# Altium schematic sheet audio.SchDoc
size A4
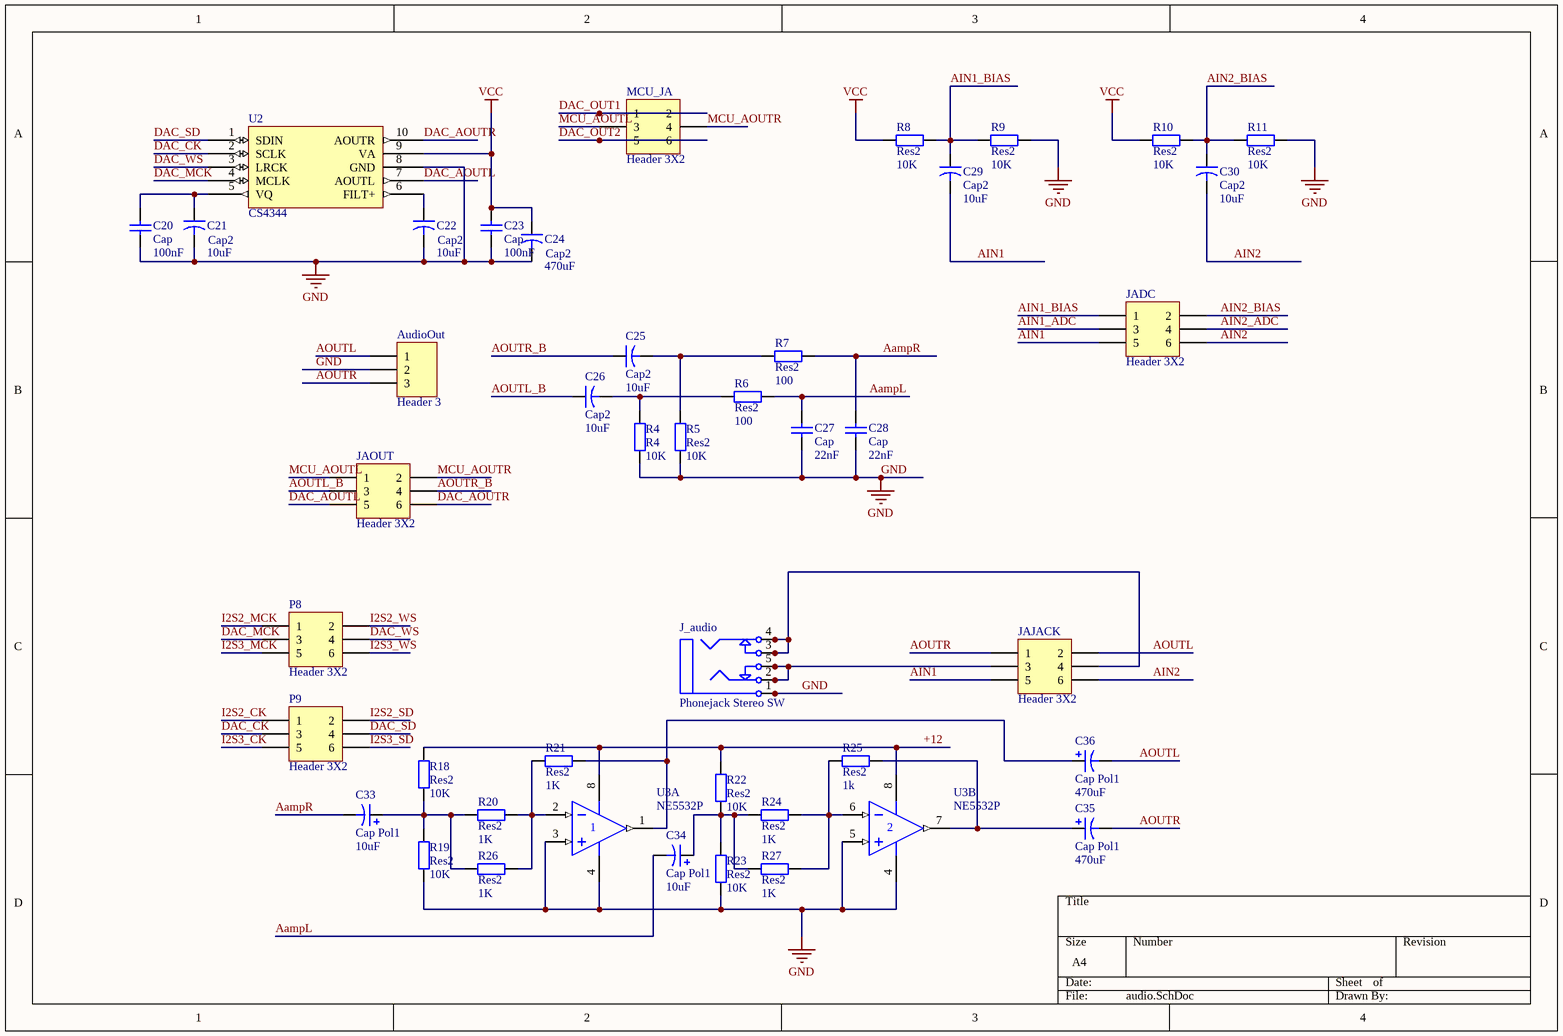
[diagram p0: audio.SchDoc]

## Parts
AudioOut  Header 3  [HDR1X3]
C20  Cap  value 100nF  [1608[0603]]
C21  Cap2  value 10uF  [Cap5x10]
C22  Cap2  value 10uF  [Cap5x10]
C23  Cap  value 100nF  [1608[0603]]
C24  Cap2  value 470uF  [Cap8*14]
C25  Cap2  value 10uF  [Cap5x10]
C26  Cap2  value 10uF  [Cap5x10]
C27  Cap  value 22nF  [1608[0603]]
C28  Cap  value 22nF  [1608[0603]]
C29  Cap2  value 10uF  [Cap5x10]
C30  Cap2  value 10uF  [Cap5x10]
C33  Cap Pol1  value 10uF  [Cap5x10]
C34  Cap Pol1  value 10uF  [Cap5x10]
C35  Cap Pol1  value 470uF  [Cap8*14]
C36  Cap Pol1  value 470uF  [Cap8*14]
J_audio  Phonejack Stereo SW  [AudioJack_3F07]
JADC  Header 3X2  [HDR2X3]
JAJACK  Header 3X2  [HDR2X3]
JAOUT  Header 3X2  [HDR2X3]
MCU_JA  Header 3X2  [HDR2X3]
P8  Header 3X2  [HDR2X3]
P9  Header 3X2  [HDR2X3]
R4  R4  value 10K  [J1-0603]
R5  Res2  value 10K  [J1-0603]
R6  Res2  value 100  [J1-0603]
R7  Res2  value 100  [J1-0603]
R8  Res2  value 10K  [J1-0603]
R9  Res2  value 10K  [J1-0603]
R10  Res2  value 10K  [J1-0603]
R11  Res2  value 10K  [J1-0603]
R18  Res2  value 10K  [J1-0603]
R19  Res2  value 10K  [J1-0603]
R20  Res2  value 1K  [J1-0603]
R21  Res2  value 1K  [J1-0603]
R22  Res2  value 10K  [J1-0603]
R23  Res2  value 10K  [J1-0603]
R24  Res2  value 1K  [J1-0603]
R25  Res2  value 1k  [J1-0603]
R26  Res2  value 1K  [J1-0603]
R27  Res2  value 1K  [J1-0603]
U2  CS4344  [CS4344]
U3  NE5532P  [P008]  (parts A,B of 2)

## Nets
GND: AudioOut.2 C20.1 C21.2 C22.2 C23.1 C24.2 C27.1 C28.1 J_audio.1 J_audio.1A J_audio.1B R4.1 R5.1 R9.2 R11.2 R19.1 R23.1 U2.8(GND) U3.3(IN+) U3.4(V-) U3.5(IN+)
VCC: C23.2 C24.1 R8.1 R10.1 U2.9(VA)
+12: R18.2 R22.2 U3.8(V+)
AampL: C27.2 C34.2 R6.2
AampR: C28.2 C33.2 R7.2
AIN1: C29.2 JADC.5 JAJACK.5
AIN1_ADC: JADC.3
AIN1_BIAS: C29.1 JADC.1 R8.2 R9.1
AIN2: C30.2 JADC.6 JAJACK.6
AIN2_ADC: JADC.4
AIN2_BIAS: C30.1 JADC.2 R10.2 R11.1
AOUTL: AudioOut.1 C36.2 JAJACK.2
AOUTL_B: C26.1 JAOUT.3
AOUTR: AudioOut.3 C35.2 JAJACK.1
AOUTR_B: C25.1 JAOUT.4
DAC_AOUTL: JAOUT.5 U2.7(AOUTL)
DAC_AOUTR: JAOUT.6 U2.10(AOUTR)
DAC_CK: P9.3 U2.2(SCLK)
DAC_MCK: P8.3 U2.4(MCLK)
DAC_OUT1: MCU_JA.1 MCU_JA.2
DAC_OUT2: MCU_JA.5 MCU_JA.6
DAC_SD: P9.4 U2.1(SDIN)
DAC_WS: P8.4 U2.3(LRCK)
I2S2_CK: P9.1
I2S2_MCK: P8.1
I2S2_SD: P9.2
I2S2_WS: P8.2
I2S3_CK: P9.5
I2S3_MCK: P8.5
I2S3_SD: P9.6
I2S3_WS: P8.6
MCU_AOUTL: JAOUT.1 MCU_JA.3
MCU_AOUTR: JAOUT.2 MCU_JA.4
NetC20_2: C20.2 C21.1 U2.5(VQ)
NetC22_1: C22.1 U2.6(FILT+)
NetC25_2: C25.2 R5.2 R7.1
NetC26_2: C26.2 R4.2 R6.1
NetC33_1: C33.1 R18.1 R19.2 R20.2 R26.2
NetC34_1: C34.1 R22.1 R23.2 R24.2 R27.2
NetC35_1: C35.1 R25.1 U3.7(OUT)
NetC36_1: C36.1 R21.1 U3.1(OUT)
NetJ_audio_2: J_audio.2 J_audio.2A J_audio.2B J_audio.5 J_audio.5A J_audio.5B JAJACK.3
NetJ_audio_3: J_audio.3 J_audio.3A J_audio.3B J_audio.4 J_audio.4A J_audio.4B JAJACK.4
NetR20_1: R20.1 R21.2 R26.1 U3.2(IN-)
NetR24_1: R24.1 R25.2 R27.1 U3.6(IN-)

## Library data of the parts
AudioOut = Header 3: Header, 3-Pin; LatestRevisionDate: 17-Jul-2002; LatestRevisionNote: Re-released for DXP Platform.; Publisher: Altium Limited
C20 C23 C27 C28 = Cap: Capacitor; Published: 8-Jun-2000; LatestRevisionDate: 17-Jul-2002; LatestRevisionNote: Re-released for DXP Platform.; PackageReference: RAD-0.3; Publisher: Altium Limited; PackageDescription: Radial Cap, Thru-Hole; 2 Leads; 0.3 in Pin Spacing
C21 C22 C24-C26 C29 C30 = Cap2: Capacitor; Published: 23-Sep-2002; PackageReference: CAPR5-4X5; Publisher: Altium Limited; PackageDescription: Capacitor; 2 Leads
C33-C36 = Cap Pol1: Polarized Capacitor (Radial); Published: 8-Jun-2000; LatestRevisionDate: 17-Jul-2002; LatestRevisionNote: Re-released for DXP Platform.; PackageReference: RB7.6-15; Publisher: Altium Limited; PackageDescription: Polarized Capacitor (Radial); 2 Leads
J_audio = Phonejack Stereo SW: 3-Conductor Jack with 2 break contacts (normals) and 2 auxiliary make contacts; pin to pad: 1A>0 1B>0 2A>0 2B>0 3>5 3A>0 3B>0 4A>0 4B>0 5>3 5A>0 5B>0; Published: 5-Jan-2004; LatestRevisionDate: 17-Dec-2003; LatestRevisionNote: PCB Footprint replaced.; DatasheetDocument: 07-Mar-2000; Publisher: Altium Limited; ComponentLink1Description: Manufacturer Link; ComponentLink1URL: http://domino.kycon.com/internet/Products.html
JADC JAJACK JAOUT MCU_JA P8 P9 = Header 3X2: Header, 3-Pin, Dual row; LatestRevisionDate: 17-Jul-2002; LatestRevisionNote: Re-released for DXP Platform.; Publisher: Altium Limited
R4-R11 R18-R27 = Res2: Resistor; Published: 8-Jun-2000; LatestRevisionDate: 17-Jul-2002; LatestRevisionNote: Re-released for DXP Platform.; PackageReference: AXIAL-0.4; Publisher: Altium Limited; PackageDescription: Axial Device, Thru-Hole; 2 Leads; 0.4 in Pin Spacing
U3 = NE5532P: Dual Low-Noise Operational Amplifier; Published: 15-Apr-2002; LatestRevisionDate: 04-Mar-2005; LatestRevisionNote: Stylized 3D Model Added.; DatasheetVersion: May-1988; PackageVersion: Jun-1999; PackageReference: P008; Publisher: Altium Limited; PackageDescription: DIP; 8 Leads; Row Spacing 7.62 mm; Pitch 2.54 mm; Code_JEDEC: MO-001-AN; ComponentLink1Description: Manufacturer Link; ComponentLink1URL: http://www.ti.com/; ComponentLink2Description: Datasheet; ComponentLink2URL: http://www-s.ti.com/sc/ds/ne5532a.pdf